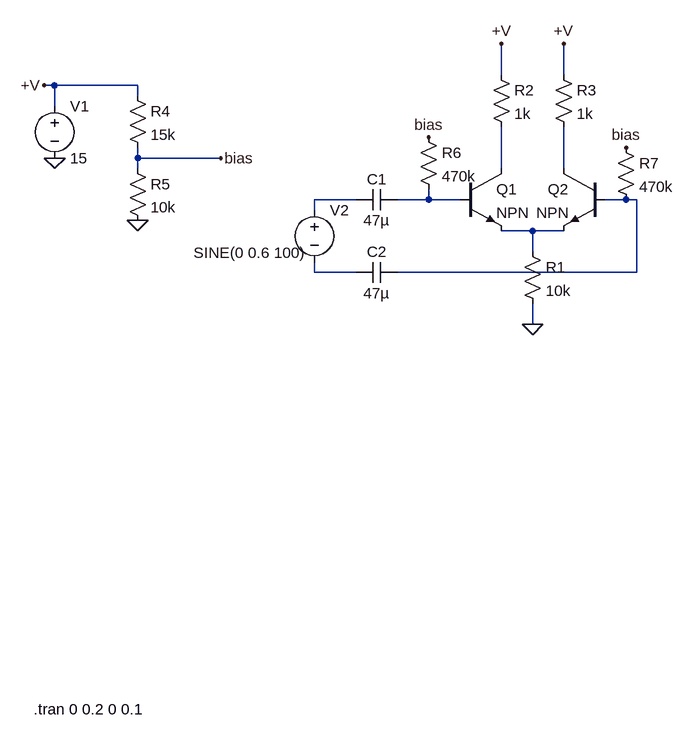
[diagram p0: schematic Gilbert Cell envelope testing.asc]
Gilbert Cell envelope testing.asc, the LTspice schematic file:
Version 4
SHEET 1 880 752
WIRE 240 -240 240 -288
WIRE 336 -240 336 -288
WIRE -448 -224 -464 -224
WIRE -320 -224 -448 -224
WIRE -320 -208 -320 -224
WIRE -448 -192 -448 -224
WIRE -320 -112 -320 -128
WIRE -192 -112 -320 -112
WIRE -320 -96 -320 -112
WIRE 240 -96 240 -160
WIRE 336 -96 336 -160
WIRE 16 -48 -48 -48
WIRE 128 -48 128 -64
WIRE 128 -48 80 -48
WIRE 176 -48 128 -48
WIRE 432 -48 400 -48
WIRE 448 -48 432 -48
WIRE -48 -32 -48 -48
WIRE 288 0 240 0
WIRE 336 0 288 0
WIRE 288 32 288 0
WIRE -48 64 -48 48
WIRE 16 64 -48 64
WIRE 448 64 448 -48
WIRE 448 64 80 64
WIRE 288 144 288 112
FLAG -448 -112 0
FLAG -464 -224 +V
FLAG 288 144 0
FLAG 240 -288 +V
FLAG 336 -288 +V
FLAG -320 -16 0
FLAG -192 -112 bias
FLAG 128 -144 bias
FLAG 432 -128 bias
SYMBOL voltage -448 -208 R0
WINDOW 123 0 0 Left 0
WINDOW 39 0 0 Left 0
SYMATTR InstName V1
SYMATTR Value 15
SYMBOL npn 176 -96 R0
SYMATTR InstName Q1
SYMBOL npn 400 -96 M0
SYMATTR InstName Q2
SYMBOL res 272 16 R0
SYMATTR InstName R1
SYMATTR Value 10k
SYMBOL voltage -48 -48 R0
WINDOW 3 -186 82 Left 2
WINDOW 123 0 0 Left 0
WINDOW 39 0 0 Left 0
SYMATTR Value SINE(0 0.6 100)
SYMATTR InstName V2
SYMBOL res 224 -256 R0
SYMATTR InstName R2
SYMATTR Value 1k
SYMBOL res 320 -256 R0
SYMATTR InstName R3
SYMATTR Value 1k
SYMBOL res -336 -224 R0
SYMATTR InstName R4
SYMATTR Value 15k
SYMBOL res -336 -112 R0
SYMATTR InstName R5
SYMATTR Value 10k
SYMBOL res 112 -160 R0
SYMATTR InstName R6
SYMATTR Value 470k
SYMBOL cap 80 -64 R90
WINDOW 0 0 32 VBottom 2
WINDOW 3 32 32 VTop 2
SYMATTR InstName C1
SYMATTR Value 47µ
SYMBOL cap 80 48 R90
WINDOW 0 0 32 VBottom 2
WINDOW 3 32 32 VTop 2
SYMATTR InstName C2
SYMATTR Value 47µ
SYMBOL res 416 -144 R0
SYMATTR InstName R7
SYMATTR Value 470k
TEXT -480 736 Left 2 !.tran 0 0.2 0 0.1

The netlist it stands for:
* Gilbert Cell envelope testing.asc
V1 +V 0 15
Q1 N001 N004 N006 0 NPN
Q2 N002 N005 N006 0 NPN
R1 N006 0 10k
V2 N003 N007 SINE(0 0.6 100)
R2 +V N001 1k
R3 +V N002 1k
R4 +V bias 15k
R5 bias 0 10k
R6 bias N004 470k
C1 N004 N003 47µ
C2 N005 N007 47µ
R7 bias N005 470k
.model NPN NPN
.model PNP PNP
.lib standard.bjt
.tran 0 0.2 0 0.1
.backanno
.end